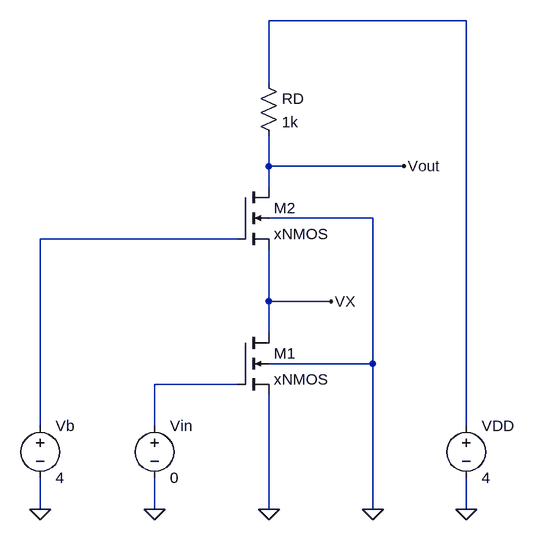
[diagram p0: schematic Chapter03D_01.fig.asc]
Chapter03D_01.fig.asc, the LTspice schematic file:
Version 4
SHEET 1 1244 1076
WIRE 768 304 464 304
WIRE 464 400 464 304
WIRE 464 528 464 480
WIRE 672 528 464 528
WIRE 464 560 464 528
WIRE 624 608 464 608
WIRE 416 640 112 640
WIRE 464 736 464 656
WIRE 560 736 464 736
WIRE 464 784 464 736
WIRE 624 832 624 608
WIRE 624 832 464 832
WIRE 416 864 288 864
WIRE 112 928 112 640
WIRE 288 928 288 864
WIRE 768 928 768 304
WIRE 112 1056 112 1008
WIRE 288 1056 288 1008
WIRE 464 1056 464 880
WIRE 624 1056 624 832
WIRE 768 1056 768 1008
FLAG 464 1056 0
FLAG 624 1056 0
FLAG 112 1056 0
FLAG 288 1056 0
FLAG 768 1056 0
FLAG 672 528 Vout
FLAG 560 736 VX
SYMBOL nmos4 416 560 R0
SYMATTR InstName M2
SYMATTR Value xNMOS
SYMBOL nmos4 416 784 R0
SYMATTR InstName M1
SYMATTR Value xNMOS
SYMBOL voltage 288 912 R0
WINDOW 123 0 0 Left 0
WINDOW 39 0 0 Left 0
SYMATTR InstName Vin
SYMATTR Value 0
SYMBOL voltage 112 912 R0
WINDOW 123 0 0 Left 0
WINDOW 39 0 0 Left 0
SYMATTR InstName Vb
SYMATTR Value 4
SYMBOL voltage 768 912 R0
SYMATTR InstName VDD
SYMATTR Value 4
SYMBOL res 448 384 R0
SYMATTR InstName RD
SYMATTR Value 1k

The netlist it stands for:
* Chapter03D_01.fig.asc
M2 Vout N002 VX 0 xNMOS
M1 VX N003 0 0 xNMOS
Vin N003 0 0
Vb N002 0 4
VDD N001 0 4
RD N001 Vout 1k
.model NMOS NMOS
.model PMOS PMOS
.lib standard.mos
.backanno
.end